# EAGLE design tobi_arduino_version (EAGLE 8.5.2)
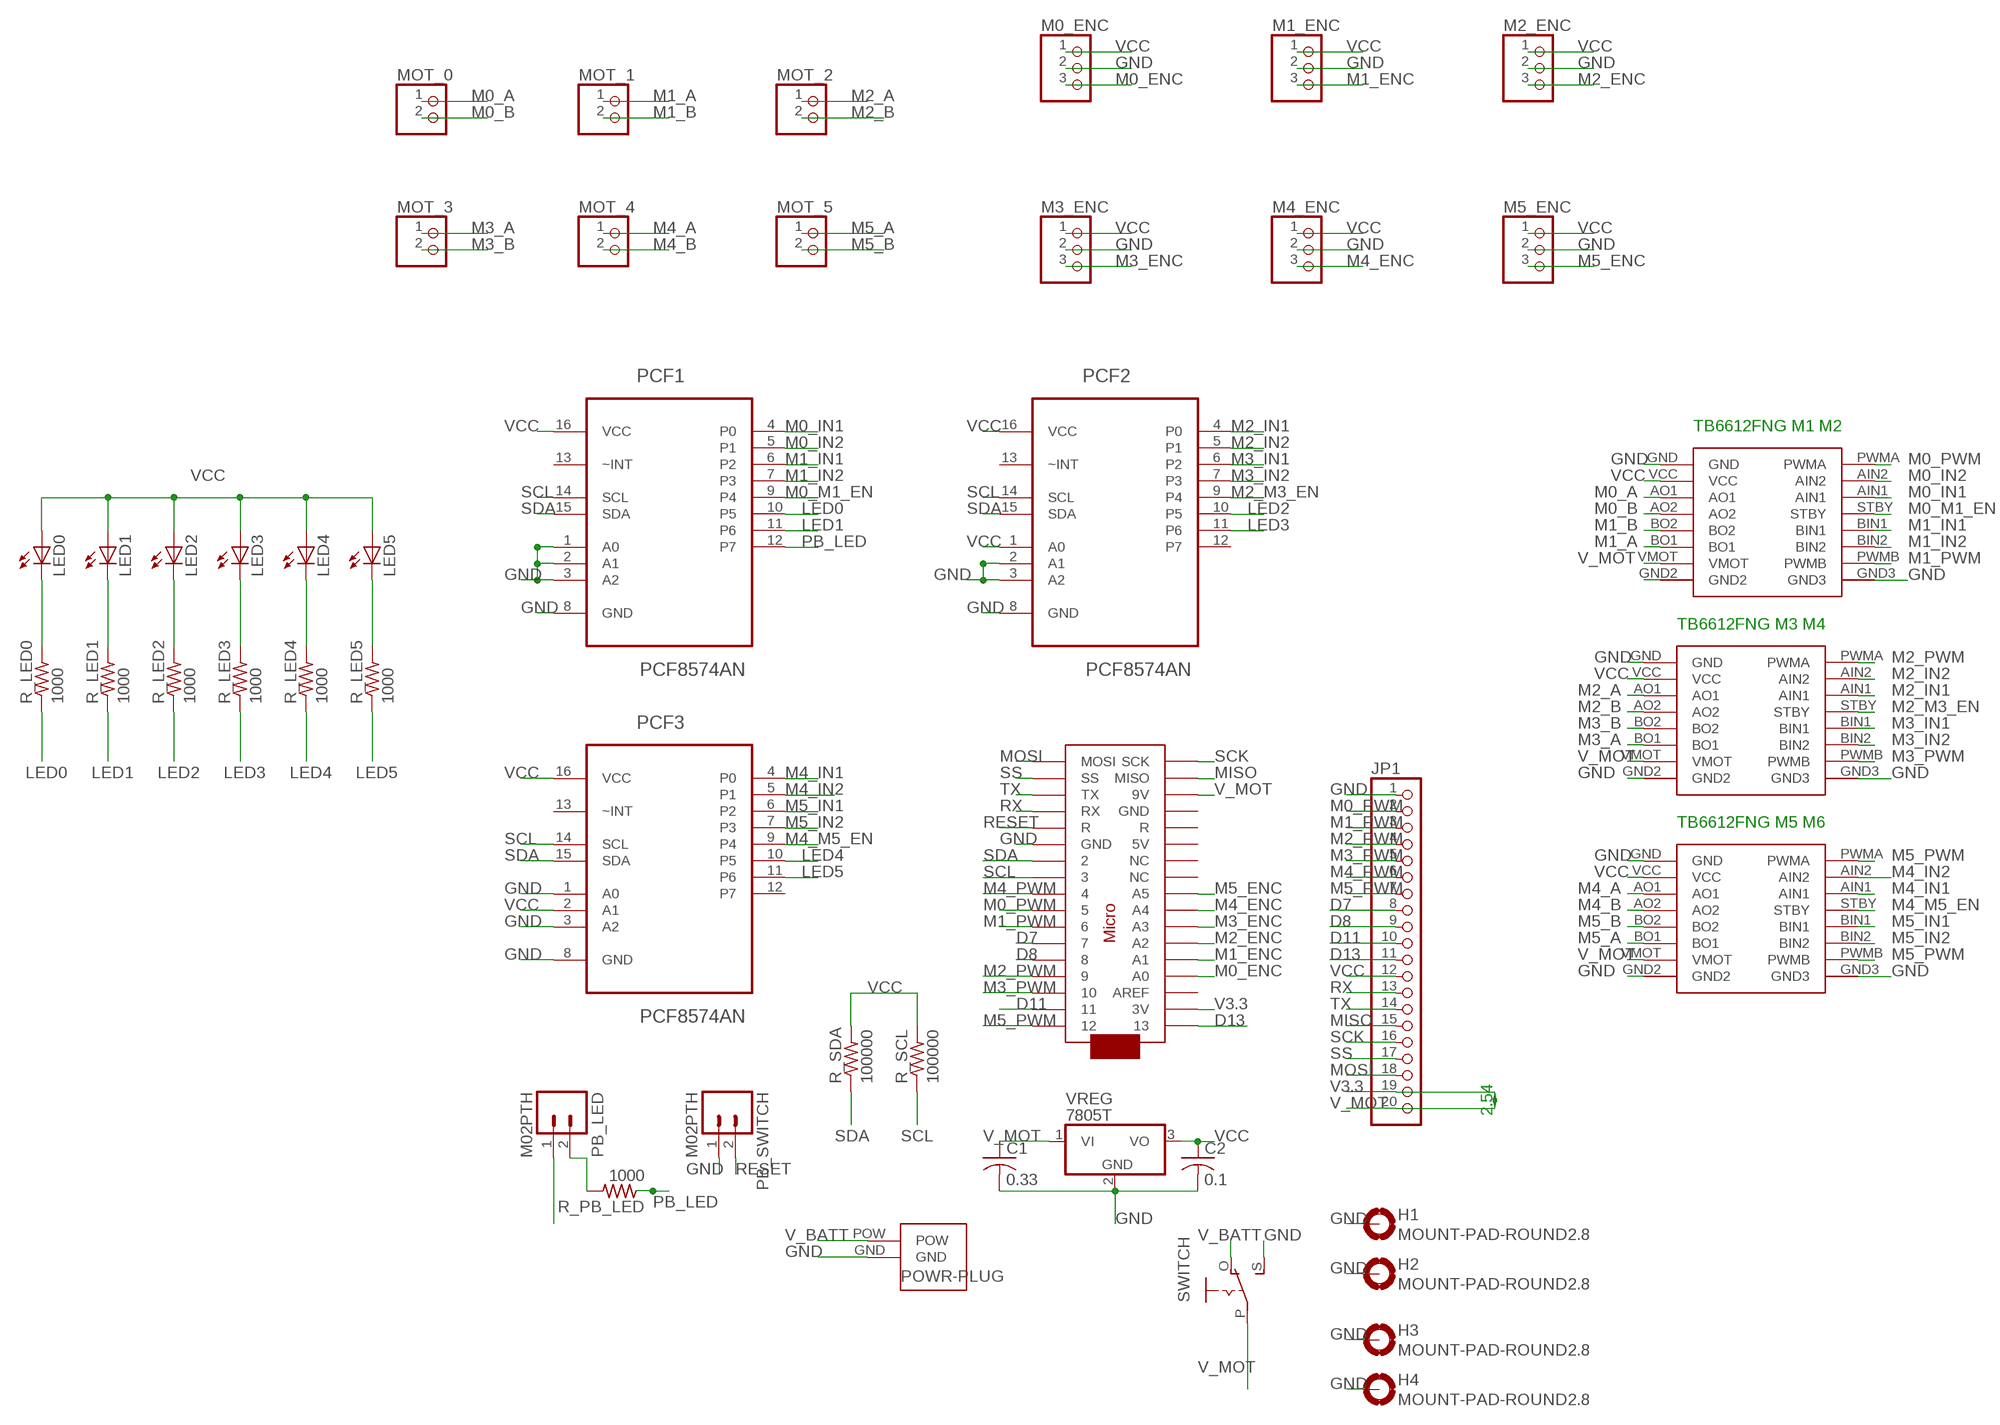
[diagram p0: schematic, sheet 1]

## Parts
ARDUINOMICRO  ARDUINOMICRO  [ARDUINOMICRO]
C1  0.33  C-US025-025X050  [C025-025X050]
C2  0.1  C-US025-025X050  [C025-025X050]
DRIVER1  POLOLU_MOTOR_DRV8835THROUGHHOLE  [POLOLU_MOTOR_DRV_DRV8835]
DRIVER2  POLOLU_MOTOR_DRV8835THROUGHHOLE  [POLOLU_MOTOR_DRV_DRV8835]
DRIVER3  POLOLU_MOTOR_DRV8835THROUGHHOLE  [POLOLU_MOTOR_DRV_DRV8835]
H1  MOUNT-PAD-ROUND2.8  [2,8-PAD]
H2  MOUNT-PAD-ROUND2.8  [2,8-PAD]
H3  MOUNT-PAD-ROUND2.8  [2,8-PAD]
H4  MOUNT-PAD-ROUND2.8  [2,8-PAD]
JP1  PINHD-1X20  [1X20]
LED0  LED3MM  [LED3MM]
LED1  LED3MM  [LED3MM]
LED2  LED3MM  [LED3MM]
LED3  LED3MM  [LED3MM]
LED4  LED3MM  [LED3MM]
LED5  LED3MM  [LED3MM]
M0_ENC  PINHD-1X3  [1X03]
M1_ENC  PINHD-1X3  [1X03]
M2_ENC  PINHD-1X3  [1X03]
M3_ENC  PINHD-1X3  [1X03]
M4_ENC  PINHD-1X3  [1X03]
M5_ENC  PINHD-1X3  [1X03]
MOT_0  PINHD-1X2  [1X02]
MOT_1  PINHD-1X2  [1X02]
MOT_2  PINHD-1X2  [1X02]
MOT_3  PINHD-1X2  [1X02]
MOT_4  PINHD-1X2  [1X02]
MOT_5  PINHD-1X2  [1X02]
PB_LED  M02PTH  [1X02]
PB_SWITCH  M02PTH  [1X02]
PCF1  PCF8574AN  [DIP254P762X508-16]
PCF2  PCF8574AN  [DIP254P762X508-16]
PCF3  PCF8574AN  [DIP254P762X508-16]
POWR-PLUG  MINI_DEANSSMD  [MINI_DEANS]
R_LED0  1000  R-US_0204/2V  [0204V]
R_LED1  1000  R-US_0204/2V  [0204V]
R_LED2  1000  R-US_0204/2V  [0204V]
R_LED3  1000  R-US_0204/2V  [0204V]
R_LED4  1000  R-US_0204/2V  [0204V]
R_LED5  1000  R-US_0204/2V  [0204V]
R_PB_LED  1000  R-US_0204/2V  [0204V]
R_SCL  100000  R-US_0204/2V  [0204V]
R_SDA  100000  R-US_0204/2V  [0204V]
SWITCH  EG1218S  [EG1218]
VREG  7805T  [TO220H]

## Nets
D7: ARDUINOMICRO.P$6 JP1.8
D8: ARDUINOMICRO.P$5 JP1.9
D11: ARDUINOMICRO.P$2 JP1.10
D13: ARDUINOMICRO.P$34 JP1.11
GND: ARDUINOMICRO.P$21(GND) C1.2 C2.2 DRIVER1.GND DRIVER1.GND2 DRIVER1.GND3 DRIVER2.GND DRIVER2.GND2 DRIVER2.GND3 DRIVER3.GND DRIVER3.GND2 DRIVER3.GND3 H1.B2,8(MOUNT) H2.B2,8(MOUNT) H3.B2,8(MOUNT) H4.B2,8(MOUNT) JP1.1 M0_ENC.2 M1_ENC.2 M2_ENC.2 M3_ENC.2 M4_ENC.2 M5_ENC.2 PB_SWITCH.1 PCF1.1(A0) PCF1.2(A1) PCF1.3(A2) PCF1.8(GND) PCF2.2(A1) PCF2.3(A2) PCF2.8(GND) PCF3.1(A0) PCF3.3(A2) PCF3.8(GND) POWR-PLUG.GND SWITCH.S VREG.2(GND)
LED0: LED0.K(C) PCF1.10(P5) R_LED0.1 R_LED0.2
LED1: LED1.K(C) PCF1.11(P6) R_LED1.1 R_LED1.2
LED2: LED2.K(C) PCF2.10(P5) R_LED2.1 R_LED2.2
LED3: LED3.K(C) PCF2.11(P6) R_LED3.1 R_LED3.2
LED4: LED4.K(C) PCF3.10(P5) R_LED4.1 R_LED4.2
LED5: LED5.K(C) PCF3.11(P6) R_LED5.1 R_LED5.2
M0_A: DRIVER1.AO1 MOT_0.1
M0_B: DRIVER1.AO2 MOT_0.2
M0_ENC: ARDUINOMICRO.P$31(A0) M0_ENC.3
M0_IN1: DRIVER1.AIN1 PCF1.4(P0)
M0_IN2: DRIVER1.AIN2 PCF1.5(P1)
M0_M1_EN: DRIVER1.STBY PCF1.9(P4)
M0_PWM: ARDUINOMICRO.P$8 DRIVER1.PWMA JP1.2
M1_A: DRIVER1.BO1 MOT_1.1
M1_B: DRIVER1.BO2 MOT_1.2
M1_ENC: ARDUINOMICRO.P$30(A1) M1_ENC.3
M1_IN1: DRIVER1.BIN1 PCF1.6(P2)
M1_IN2: DRIVER1.BIN2 PCF1.7(P3)
M1_PWM: ARDUINOMICRO.P$7 DRIVER1.PWMB JP1.3
M2_A: DRIVER2.AO1 MOT_2.1
M2_B: DRIVER2.AO2 MOT_2.2
M2_ENC: ARDUINOMICRO.P$29(A2) M2_ENC.3
M2_IN1: DRIVER2.AIN1 PCF2.4(P0)
M2_IN2: DRIVER2.AIN2 PCF2.5(P1)
M2_M3_EN: DRIVER2.STBY PCF2.9(P4)
M2_PWM: ARDUINOMICRO.P$4 DRIVER2.PWMA JP1.4
M3_A: DRIVER2.BO1 MOT_3.1
M3_B: DRIVER2.BO2 MOT_3.2
M3_ENC: ARDUINOMICRO.P$28(A3) M3_ENC.3
M3_IN1: DRIVER2.BIN1 PCF2.6(P2)
M3_IN2: DRIVER2.BIN2 PCF2.7(P3)
M3_PWM: ARDUINOMICRO.P$3 DRIVER2.PWMB JP1.5
M4_A: DRIVER3.AO1 MOT_4.1
M4_B: DRIVER3.AO2 MOT_4.2
M4_ENC: ARDUINOMICRO.P$27(A4) M4_ENC.3
M4_IN1: DRIVER3.AIN1 PCF3.4(P0)
M4_IN2: DRIVER3.AIN2 PCF3.5(P1)
M4_M5_EN: DRIVER3.STBY PCF3.9(P4)
M4_PWM: ARDUINOMICRO.P$9 JP1.6
M5_A: DRIVER3.BO1 MOT_5.1
M5_B: DRIVER3.BO2 MOT_5.2
M5_ENC: ARDUINOMICRO.P$26(A5) M5_ENC.3
M5_IN1: DRIVER3.BIN1 PCF3.6(P2)
M5_IN2: DRIVER3.BIN2 PCF3.7(P3)
M5_PWM: ARDUINOMICRO.P$1 DRIVER3.PWMA DRIVER3.PWMB JP1.7
MISO: ARDUINOMICRO.P$19(MISO) JP1.15
MOSI: ARDUINOMICRO.P$17(MOSI) JP1.18
N$1: PB_LED.2 R_PB_LED.2
PB_LED: PCF1.12(P7) R_PB_LED.1
RESET: ARDUINOMICRO.P$22(R) PB_SWITCH.2
RX: ARDUINOMICRO.P$14(RX) JP1.13
SCK: ARDUINOMICRO.P$18(SCK) JP1.16
SCL: ARDUINOMICRO.P$10 PCF1.14(SCL) PCF2.14(SCL) PCF3.14(SCL) R_SCL.1
SDA: ARDUINOMICRO.P$11 PCF1.15(SDA) PCF2.15(SDA) PCF3.15(SDA) R_SDA.1
SS: ARDUINOMICRO.P$16(SS) JP1.17
TX: ARDUINOMICRO.P$15(TX) JP1.14
V3.3: ARDUINOMICRO.P$33(3V) JP1.19
V_BATT: POWR-PLUG.POW SWITCH.O
V_MOT: ARDUINOMICRO.P$20(9V) C1.1 DRIVER1.VMOT DRIVER2.VMOT DRIVER3.VMOT JP1.20 SWITCH.P VREG.1(VI)
VCC: C2.1 DRIVER1.VCC DRIVER2.VCC DRIVER3.VCC JP1.12 LED0.A LED1.A LED2.A LED3.A LED4.A LED5.A M0_ENC.1 M1_ENC.1 M2_ENC.1 M3_ENC.1 M4_ENC.1 M5_ENC.1 PB_LED.1 PCF1.16(VCC) PCF2.1(A0) PCF2.16(VCC) PCF3.2(A1) PCF3.16(VCC) R_SCL.2 R_SDA.2 VREG.3(VO)
Unconnected: ARDUINOMICRO.P$12(GND) ARDUINOMICRO.P$13(R) ARDUINOMICRO.P$23(5V) ARDUINOMICRO.P$24(NC) ARDUINOMICRO.P$25(NC) ARDUINOMICRO.P$32(AREF) PCF1.13(~INT) PCF2.12(P7) PCF2.13(~INT) PCF3.12(P7) PCF3.13(~INT)

## Notes on the sheet
- TB6612FNG M1 M2
- TB6612FNG M3 M4
- TB6612FNG M5 M6

## Library data of the parts
ARDUINOMICRO = adafruit:ARDUINOMICRO
C1 C2 = adafruit:C-US: CAPACITOR, American symbol
DRIVER1-DRIVER3 = pololu:POLOLU_MOTOR_DRV8835
H1-H4 = holes:MOUNT-PAD-ROUND: MOUNTING PAD, round
JP1 = adafruit:PINHD-1X20: PIN HEADER
LED0 LED1-LED5 = adafruit:LED: LED OSRAM: - CHIPLED LG R971, LG N971, LY N971, LG Q971, LY Q971, LO R971, LY R971 LH N974, LH R974 LS Q976, LO Q976, LY Q976 LO Q996 - Hyper CHIPLED LW Q18S LB Q993, LB Q99A, LB R99A - SideLED LS A670, LO A670, LY A670, LG A670, LP A670 LB A673, LV A673, LT A673, LW A673 LH A674 LY A675 LS A676, LA A676, LO A676, LY A676, LW A676 LS A679, LY A679, LG A679 - Hyper Micro SIDELED® LS Y876, LA Y876, LO Y876, LY Y876 LT Y87S - SmartLED LW L88C, LW L88S LB L89C, LB L89S, LG L890 LS L89K, LO L89K, LY L89K LS L896, LA L896, LO L896, LY L896 - TOPLED LS T670, LO T670, LY T670, LG T670, LP T670 LSG T670, LSP T670, LSY T670, LOP T670, LYG T670 LG T671, LOG T671, LSG T671 LB T673, LV T673, LT T673, LW T673 LH T674 LS T676, LA T676, LO T676, LY T676, LB T676, LH T676, LSB T676, LW T676 LB T67C, LV T67C, LT T67C, LS T67K, LO T67K, LY T67K, LW E67C LS E67B, LA E67B, LO E67B, LY E67B, LB E67C, LV E67C, LT E67C LW T67C LS T679, LY T679, LG T679 LS T770, LO T770, LY T770, LG T770, LP T770 LB T773, LV T773, LT T773, LW T773 LH T774 LS E675, LA E675, LY E675, LS T675 LS T776, LA T776, LO T776, LY T776, LB T776 LHGB T686 LT T68C, LB T68C - Hyper Mini TOPLED® LB M676 - Mini TOPLED Santana® LG M470 LS M47K, LO M47K, LY M47K Source: http://www.osram.convergy.de/
M0_ENC M1_ENC M2_ENC M3_ENC M4_ENC M5_ENC = pinhead:PINHD-1X3: PIN HEADER
MOT_0 MOT_1-MOT_5 = pinhead:PINHD-1X2: PIN HEADER
PB_LED PB_SWITCH = SparkFun-Connectors:M02: Standard 2-pin 0.1" header. Use with - straight break away headers ( PRT-00116) - right angle break away headers (PRT-00553) - swiss pins (PRT-00743) - machine pins (PRT-00117) - female headers (PRT-00115) Molex polarized connector foot print use with: PRT-08233 with associated crimp pins and housings. 2.54_SCREWTERM for use with PRT-10571. 3.5mm Screw Terminal footprints for PRT-08084 5mm Screw Terminal footprints for use with PRT-08433
PCF1-PCF3 = Texas Instruments_By_element14_Batch_1:PCF8574AN: REMOTE 8-BIT I/O EXPANDER FOR I2C BUS; MPN: PCF8574AN; OC_FARNELL: 1703443; OC_NEWARK: 75C5234; PACKAGE: PDIP-16; SUPPLIER: Texas Instruments
POWR-PLUG = SparkFun-Connectors:MINI_DEANS: EB-85A Connector Proven layout and schematic for ETek 5Hz GPS receiver connector. Spark Fun Electronics SKU : GPS-08297
R_LED0 R_LED1-R_LED5 R_PB_LED R_SCL R_SDA = resistor:R-US_: RESISTOR, American symbol
SWITCH = adafruit:EG1218: SLIDING SWITCH 0.1" spacing through hole, vertical SPDT slide switch http://www.ladyada.net/library/pcb/eaglelibrary.html
VREG = adafruit:78*: Positive VOLTAGE REGULATOR Added bigger pads to the TO-92 package

## Net classes
0 default: width 0.254 mm, clearance 0.127 mm

## Board
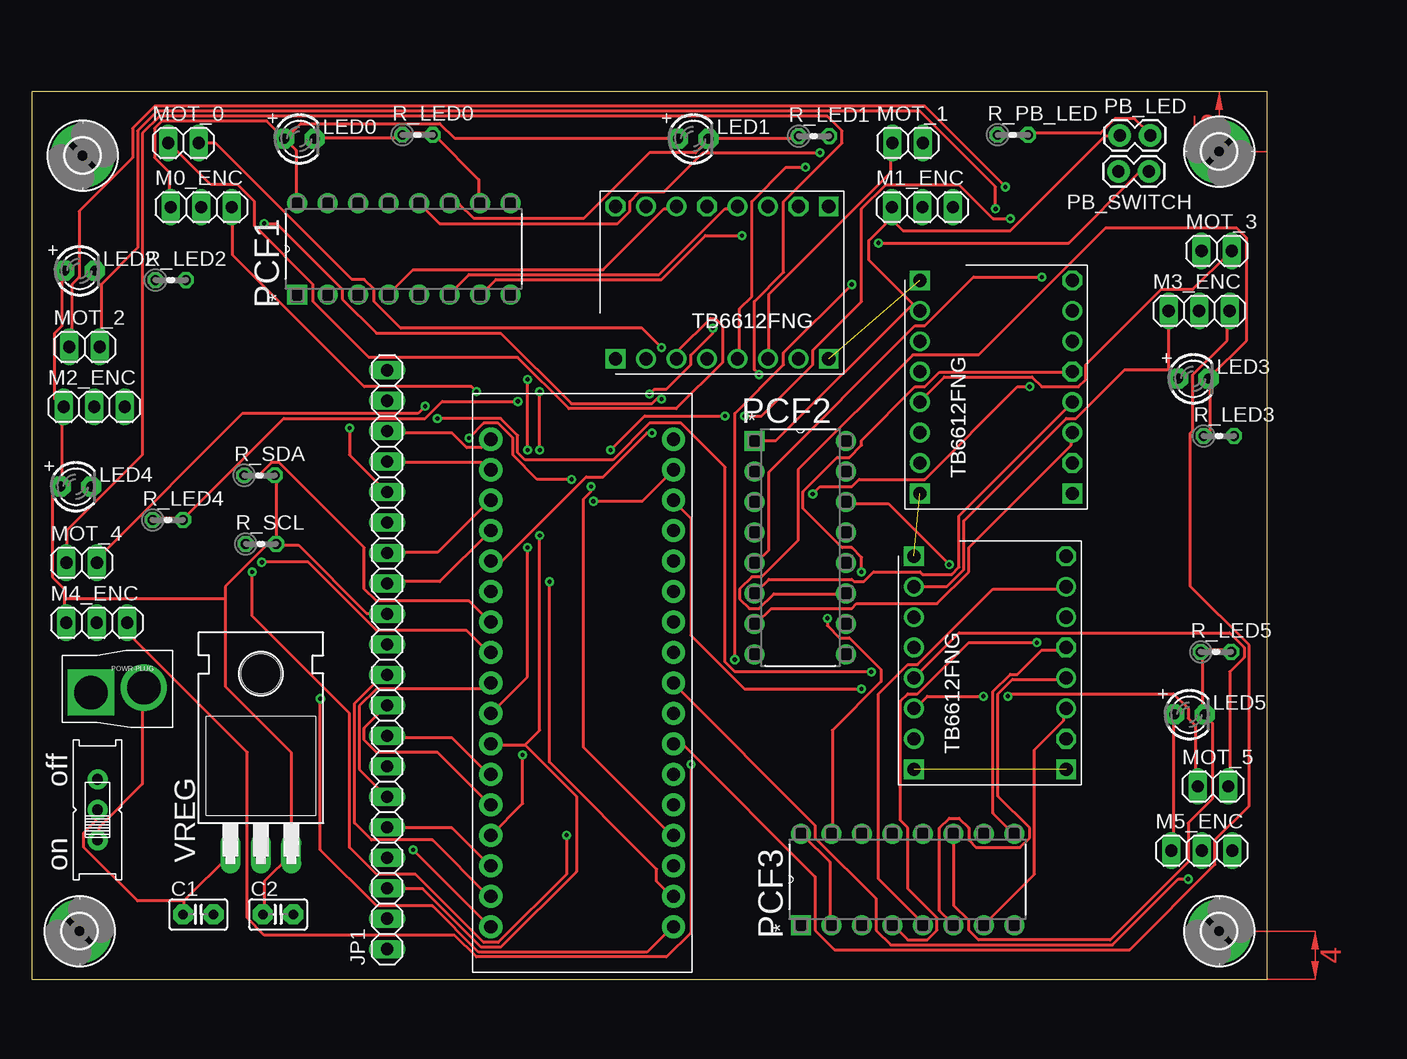
[diagram p1: board, top side]
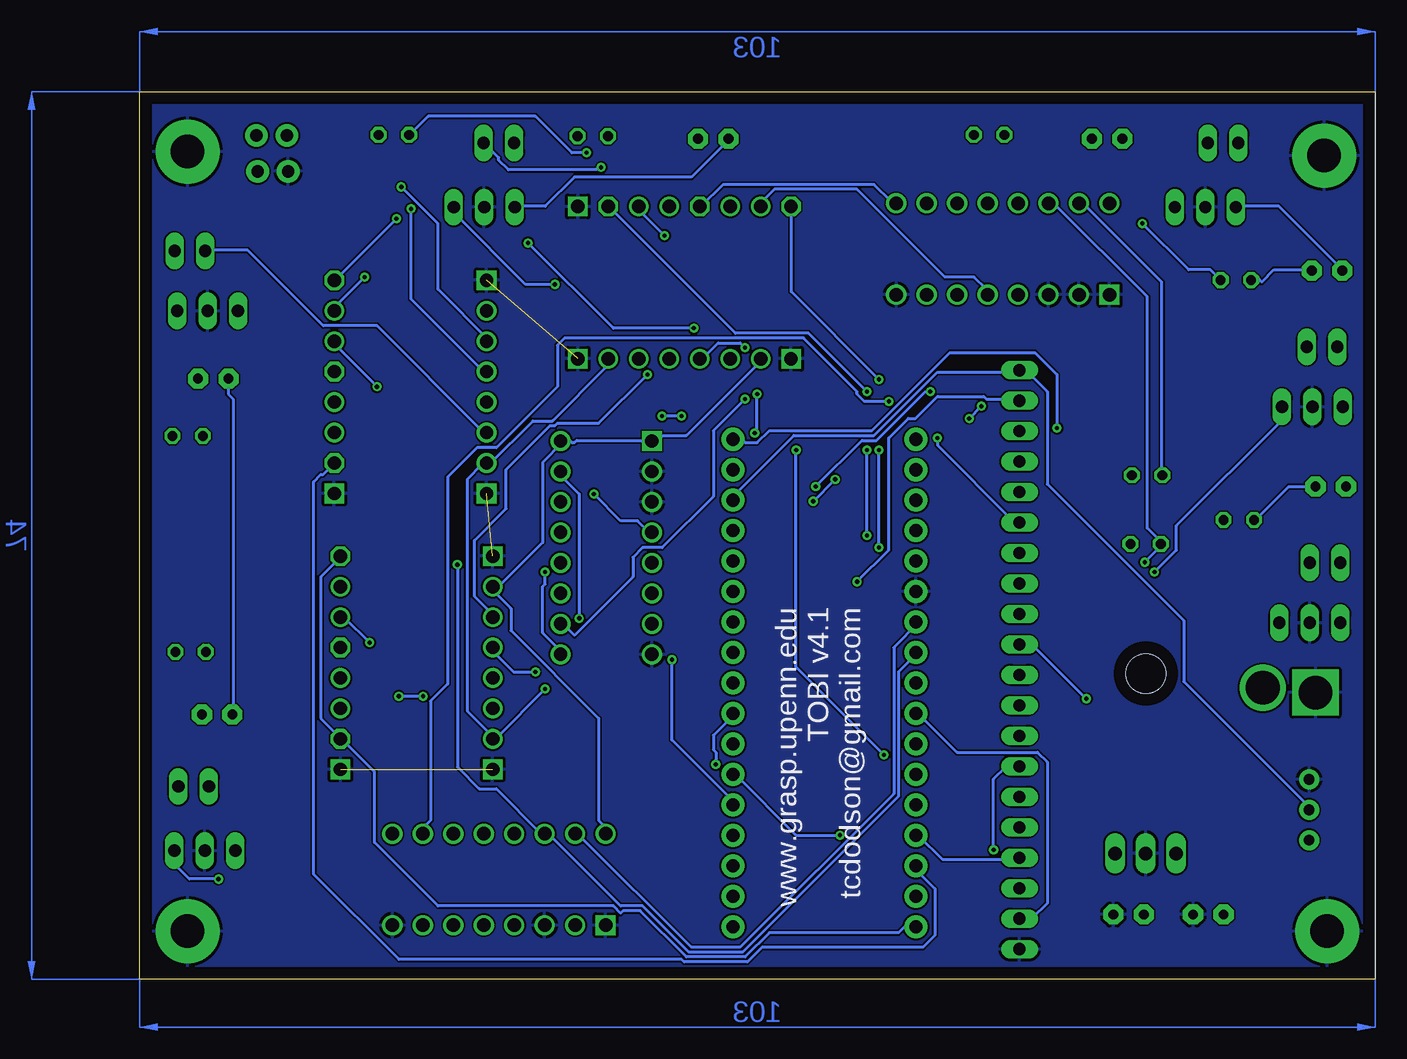
[diagram p2: board, bottom side, seen from below]

Size 103 x 74 mm. Coordinates in mm from the lower left corner, seen from the top.
Outline: 0,0 103,0 103,74 0,74 0,0
Copper layers (1*16): Top 0.035mm / dielectric 1.5mm / Bottom 0.035mm
Design rules "default": minimum track width 6mil, minimum drill 0.35mm, track to track 6mil, track to pad 6mil, pad to pad 6mil, via to via 6mil, smd to smd 6mil, copper to edge 40mil, drill to drill 6mil, minimum pad ring 10mil, minimum via ring 8mil, stop-mask expansion 4mil, vias tented up to drill 0mil, thermal gap 10mil

### Footprints (pad centres in the part's own frame; a part is rotated, then mirrored left to right if it is on the bottom)
ARDUINOMICRO = drill 1.1 pad 1.93: P$1 -20.32,7.62; P$2 -17.78,7.62; P$3 -15.24,7.62; P$4 -12.7,7.62; P$5 -10.16,7.62; P$6 -7.62,7.62; P$7 -5.08,7.62; P$8 -2.54,7.62; P$9 0,7.62; P$10 2.54,7.62; P$11 5.08,7.62; P$12 12.7,-7.62; P$13 10.16,-7.62; P$14 12.7,7.62; P$15 15.24,7.62; P$16 17.78,7.62; P$17 20.32,7.62; P$18 20.32,-7.62; P$19 17.78,-7.62; P$20 15.24,-7.62; P$21 7.62,7.62; P$22 10.16,7.62; P$23 7.62,-7.62; P$24 5.08,-7.62; P$25 2.54,-7.62; P$26 0,-7.62; P$27 -2.54,-7.62; P$28 -5.08,-7.62; P$29 -7.62,-7.62; P$30 -10.16,-7.62; P$31 -12.7,-7.62; P$32 -15.24,-7.62; P$33 -17.78,-7.62; P$34 -20.32,-7.62
C025-025X050 = drill 0.813 pad 1.676 octagon: 1 -1.27,0; 2 1.27,0
POLOLU_MOTOR_DRV_DRV8835 = drill 1.1: AIN1 13.97,13.97; AIN2 13.97,16.51; AO1 1.27,13.97; AO2 1.27,11.43; BIN1 13.97,8.89; BIN2 13.97,6.35; BO1 1.27,6.35; BO2 1.27,8.89; VCC 1.27,16.51; VMOT 1.27,3.81 | drill 1.1 square: GND 1.27,19.05; GND2 1.27,1.27; GND3 13.97,1.27 | drill 1.1 octagon: PWMA 13.97,19.05; PWMB 13.97,3.81; STBY 13.97,11.43
2,8-PAD = drill 2.8 pad 5.334: B2,8 0,0
1X20 = drill 1.016 long: 1 -24.13,0; 2 -21.59,0; 3 -19.05,0; 4 -16.51,0; 5 -13.97,0; 6 -11.43,0; 7 -8.89,0; 8 -6.35,0; 9 -3.81,0; 10 -1.27,0; 11 1.27,0; 12 3.81,0; 13 6.35,0; 14 8.89,0; 15 11.43,0; 16 13.97,0; 17 16.51,0; 18 19.05,0; 19 21.59,0; 20 24.13,0
LED3MM = drill 0.813 pad 1.676 octagon: A -1.27,0; K 1.27,0
1X03 = drill 1.016 long: 1 -2.54,0; 2 0,0; 3 2.54,0
1X02 = drill 1.016 long: 1 -1.27,0; 2 1.27,0
1X02' = drill 1.016 pad 1.88: 1 0,0; 2 2.54,0
DIP254P762X508-16 = drill 1.118 square: 1 -7.62,17.78 | drill 1.118: 2 -7.62,15.24; 3 -7.62,12.7; 4 -7.62,10.16; 5 -7.62,7.62; 6 -7.62,5.08; 7 -7.62,2.54; 8 -7.62,0; 9 0,0; 10 0,2.54; 11 0,5.08; 12 0,7.62; 13 0,10.16; 14 0,12.7; 15 0,15.24; 16 0,17.78
MINI_DEANS = drill 2.8 pad 3.85 square: GND -1.7,-0.5 | drill 2.8 pad 3.85: POW 2.7,-0.1
0204V = drill 0.813 octagon: 1 -1.27,0; 2 1.27,0
EG1218 = drill 0.9 pad 1.676: O -2.54,0; P 0,0; S 2.54,0
TO220H = drill 1.118 long: 1 -2.54,-10.16; 2 0,-10.16; 3 2.54,-10.16 | hole 3.302: 0,4.826

### Placement (x,y rotation side)
ARDUINOMICRO  45.9,24.69 90 top
C1  13.9,5.39 0 top
C2  20.55,5.39 0 top
DRIVER1  67.73,50.45 90 top
DRIVER2  72.79,39.21 0 top
DRIVER3  72.28,16.21 0 top
H1  4,4 0 top
H2  99,4 0 top
H3  99,69 270 top
H4  4.25,68.66 0 top
JP1  29.64,26.63 90 top
LED0  22.33,70.06 0 top
LED1  55.17,70.06 0 top
LED2  4.01,59.06 0 top
LED3  96.85,50.06 0 top
LED4  3.69,41.06 0 top
LED5  96.53,22.06 0 top
M0_ENC  14.15,64.36 0 top
M1_ENC  74.26,64.36 0 top
M2_ENC  5.22,47.71 0 top
M3_ENC  97.33,55.71 0 top
M4_ENC  5.44,29.71 0 top
M5_ENC  97.55,10.71 0 top
MOT_0  12.66,69.71 0 top
MOT_1  73.04,69.71 0 top
MOT_2  4.42,52.71 0 top
MOT_3  98.8,60.71 0 top
MOT_4  4.18,34.71 0 top
MOT_5  98.49,16.06 0 top
PB_LED  M02PTH  [1X02']  90.72,70.34 0 top
PB_SWITCH  M02PTH  [1X02']  90.61,67.34 0 top
PCF1  39.92,64.68 90 top
PCF2  67.9,27.08 0 top
PCF3  81.92,12.12 90 top
POWR-PLUG  6.66,24.39 0 top
R_LED0  32.18,70.39 0 top
R_LED1  65.22,70.28 0 top
R_LED2  11.6,58.28 0 top
R_LED3  98.98,45.28 0 top
R_LED4  11.36,38.28 0 top
R_LED5  98.74,27.28 0 top
R_PB_LED  81.8,70.39 0 top
R_SCL  19.12,36.28 0 top
R_SDA  19,42 0 top
SWITCH  5.5,14.12 90 top
VREG  19.12,20.64 0 top

### Tracks (layer width: path | path; a pad name or v marks a point on that pad's centre or on a via)
D7
  Top 0.254: JP1.8 29.77,20.13 35.05,20.13 38.1,17.08 ARDUINOMICRO.P$6
D8
  Top 0.254: JP1.9 29.56,22.77 27.73,20.94 27.73,19.92 28.75,18.91 33.83,18.91 38.1,14.64 ARDUINOMICRO.P$5
D11
  Top 0.254: JP1.10 29.56,25.21 29.16,25.21 26.92,22.97 26.92,13.01 28.34,11.59 33.42,11.59 38.1,6.92 ARDUINOMICRO.P$2
D13  (via drill 0.35)
  Top 0.254: v24.08,23.38 24.08,10.78 28.75,6.11 33.42,6.11 37.28,2.25 51.31,2.25 53.34,4.28 ARDUINOMICRO.P$34
  Bottom 0.254: v24.08,23.38 28.55,27.85 29.56,27.85 JP1.11
GND  (3 unrouted)
  pour Bottom: 0,0 103,0 103,74 0,74
LED0
  Top 0.254: PCF1.10 37.28,64.83 37.28,66.66 33.63,70.32 R_LED0.2 33.42,70.52 30.99,70.52 R_LED0.1 30.78,70.32 30.58,70.11 23.67,70.11 LED0.K
LED1
  Top 0.254: R_LED1.2 66.34,70.32 64.11,70.32 R_LED1.1 63.9,70.11 56.59,70.11 LED1.K 56.39,69.91 55.37,68.89 51.51,68.89 46.02,63.41 36.88,63.41 35.66,64.63 34.85,64.63 PCF1.11
LED2  (via drill 0.35)
  Top 0.254: R_LED2.1 10.46,58.33 12.7,58.33 R_LED2.2 | v52.53,48.37 52.12,48.37 51.71,47.97 45.01,47.97 39.11,53.86 28.75,53.86 25.91,56.7 25.91,57.52 20.42,63 v19.4,63
  Bottom 0.254: LED2.K 5.38,59.14 8.43,59.14 9.45,58.12 9.65,58.33 10.26,58.33 R_LED2.1 | v52.53,48.37 55.17,45.73 55.17,40.24 59.43,35.98 61.06,35.98 61.87,35.16 61.87,33.54 66.75,28.66 67.56,29.47 67.77,29.47 PCF2.10 | v19.4,63 15.54,59.14 13.71,59.14 12.9,58.33 R_LED2.2
LED3
  Top 0.254: 98.25,45.32 100.07,45.32 R_LED3.2 | 98.25,45.32 97.84,45.32 R_LED3.1 98.25,45.32 | PCF2.11 67.77,32.12 61.87,32.12 60.65,30.9 59.84,30.9 59.03,31.71 59.03,32.52 60.04,33.54 60.86,33.54 63.9,36.59 63.9,42.48 73.45,52.03 78.94,52.03 89.51,62.59 100.48,62.59 101.29,61.78 101.29,53.25 98.25,50.2 LED3.K 98.25,50 98.25,45.32
LED4  (via drill 0.35)
  Top 0.254: R_LED4.1 10.26,38.41 12.49,38.41 R_LED4.2 12.7,38.41 21.03,46.75 32.81,46.75 34.24,48.17 v40.54,48.17
  Bottom 0.254: LED4.K 4.98,41.06 7.21,41.06 10.06,38.21 R_LED4.1 | v40.54,48.17 42.57,48.17 43.18,48.78 43.18,48.98 47.65,53.45 67.56,53.45 68.17,52.84 68.17,49.39 73.25,44.31 74.88,44.31 77.31,41.87 77.31,24.6 78.74,23.17 78.74,13.22 79.35,12.61 79.35,12.2 PCF3.10
LED5
  Top 0.254: R_LED5.2 99.87,27.44 97.63,27.44 R_LED5.1 97.63,27.24 97.63,22.16 LED5.K 97.84,21.95 98.45,21.35 98.45,15.05 96.42,13.01 96.42,9.76 89.91,3.26 78.94,3.26 78.13,4.07 78.13,4.89 76.91,6.11 76.91,12 PCF3.11
M0_A
  Top 0.254: MOT_0.1 11.48,69.71 14.93,66.25 17.17,66.25 18.59,64.83 18.59,62.8 23.47,57.92 23.47,56.5 28.14,51.83 40.54,51.83 44.8,47.56 53.74,47.56 57.61,51.42 57.61,54.47 57,55.08 56.59,55.08 53.95,52.44 53.95,51.83 DRIVER1.AO1
M0_B  (via drill 0.35)
  Top 0.254: v52.53,52.64 50.9,54.26 30.78,54.26 28.55,56.5 28.55,57.52 27.73,58.33 26.72,58.33 15.34,69.71 14.12,69.71 MOT_0.2
  Bottom 0.254: v52.53,52.64 52.93,53.05 54.76,53.05 56.18,51.62 DRIVER1.AO2
M0_ENC  (via drill 0.35)
  Top 0.254: v37.08,48.98 36.67,49.39 27.73,49.39 16.76,60.36 16.76,64.22 M0_ENC.3 | v46.63,41.06 46.63,40.65 46.02,40.04 46.02,19.31 53.34,12 ARDUINOMICRO.P$31
  Bottom 0.254: v37.08,48.98 37.49,48.98 41.55,44.92 42.77,44.92 v46.63,41.06
M0_IN1
  Top 0.254: DRIVER1.AIN1 53.74,64.22 52.73,64.22 47.65,59.14 31.8,59.14 29.77,57.11 PCF1.4
M0_IN2
  Bottom 0.254: DRIVER1.AIN2 51.1,64.42 51.1,64.83 50.09,65.85 43.18,65.85 35.86,58.53 33.42,58.53 32.41,57.52 32.41,57.11 PCF1.5
M0_M1_EN
  Bottom 0.254: DRIVER1.STBY 56.18,64.42 54.35,66.25 41.75,66.25 40.33,64.83 39.93,64.83 PCF1.9
M0_PWM  (via drill 0.35)
  Top 0.254: v41.35,44.1 v41.35,50 | v41.35,35.98 41.35,25.21 38.3,22.16 ARDUINOMICRO.P$8
  Bottom 0.254: JP1.2 29.56,5.09 28.55,5.09 27.33,6.31 27.33,18.09 28.14,18.91 34.85,18.91 38.1,22.16 ARDUINOMICRO.P$8 | v41.35,50 48.66,57.31 48.66,64.22 DRIVER1.PWMA | v41.35,35.98 v41.35,44.1
M1_A
  Top 0.254: MOT_1.1 71.63,69.71 71.63,67.27 61.47,57.11 61.47,51.83 DRIVER1.BO1
M1_B  (via drill 0.35)
  Top 0.254: v64.51,67.67 62.89,67.67 60.04,64.83 60.04,56.91 59.03,55.89 59.03,51.83 DRIVER1.BO2
  Bottom 0.254: v64.51,67.67 64.72,67.47 72.24,67.47 73.05,68.28 73.05,68.49 74.27,69.71 MOT_1.2
M1_ENC  (via drill 0.35)
  Top 0.254: v68.37,57.92 62.69,52.23 62.69,51.22 58.62,47.15 v58.62,26.63
  Bottom 0.254: v68.37,57.92 70.81,57.92 76.71,63.81 76.71,64.22 M1_ENC.3 | v58.62,26.63 58.62,19.92 53.34,14.64 ARDUINOMICRO.P$30
M1_IN1
  Top 0.254: DRIVER1.BIN1 58.82,64.22 57.81,64.22 52.32,58.73 36.47,58.73 34.85,57.11 PCF1.6
M1_IN2  (via drill 0.35)
  Top 0.254: v59.23,61.99 56.18,61.99 52.53,58.33 38.71,58.33 37.49,57.11 PCF1.7
  Bottom 0.254: v59.23,61.99 61.26,64.02 61.26,64.22 DRIVER1.BIN2
M1_PWM  (via drill 0.35)
  Top 0.254: 41.15,19.52 45.41,15.25 45.41,8.95 39.11,2.65 37.49,2.65 32.61,7.53 29.77,7.53 JP1.3 | 41.15,19.52 38.3,19.52 ARDUINOMICRO.P$7 | v42.36,44.1 v42.36,48.98 | v42.36,36.99 42.36,20.74 41.15,19.52
  Bottom 0.254: v42.36,48.98 47.24,53.86 53.34,53.86 63.7,64.22 63.9,64.22 DRIVER1.PWMB | v42.36,36.99 v42.36,44.1
M2_A  (via drill 0.35)
  Top 0.254: v81.18,66.05 74.47,72.75 10.26,72.75 8.43,70.93 8.43,68.49 3.96,64.02 3.96,58.53 3.35,57.92 3.35,52.84 MOT_2.1
  Bottom 0.254: v81.18,66.05 78.13,63 78.13,57.52 73.86,53.25 DRIVER2.AO1
M2_B  (via drill 0.35)
  Top 0.254: v80.36,64.22 80.36,66.05 74.06,72.35 10.46,72.35 8.84,70.72 8.84,60.97 5.79,57.92 5.79,52.84 MOT_2.2
  Bottom 0.254: v80.36,64.22 80.36,56.7 74.47,50.81 74.06,50.81 DRIVER2.AO2
M2_ENC  (via drill 0.35)
  Top 0.254: v18.39,33.94 18.39,30.29 26.52,22.16 26.52,10.98 28.75,8.75 32,8.75 37.69,3.06 38.91,3.06 44.6,8.75 v44.6,12
  Bottom 0.254: v18.39,33.94 16.56,35.77 16.56,37.8 7.82,46.54 7.82,47.56 M2_ENC.3 | v44.6,12 48.26,12 53.34,17.08 ARDUINOMICRO.P$29
M2_IN1  (via drill 0.35)
  Top 0.254: v83.21,49.39 82.19,49.39 74.47,41.67 68.98,41.67 68.37,41.06 65.73,41.06 v65.12,40.45
  Bottom 0.254: v83.21,49.39 86.66,52.84 86.66,53.05 DRIVER2.AIN1 | v65.12,40.45 62.89,38.21 61.47,38.21 60.45,37.2 PCF2.4
M2_IN2  (via drill 0.35)
  Top 0.254: v84.22,58.53 78.53,58.53 74.47,54.47 73.66,54.47 61.47,42.28 61.47,35.77 60.45,34.76 PCF2.5
  Bottom 0.254: v84.22,58.53 86.66,56.09 86.66,55.89 DRIVER2.AIN2
M2_M3_EN  (via drill 0.35)
  Top 0.254: v69.19,33.94 69.19,35.16 68.37,35.98 67.56,35.98 64.31,39.23 64.31,40.65 67.16,43.49 68.17,43.49 69.19,44.51 69.19,44.92 73.66,49.39 74.47,49.39 75.69,50.61 86.66,50.61 DRIVER2.STBY
  Bottom 0.254: v69.19,33.94 69.19,32.93 69.39,32.73 69.39,28.86 67.77,27.24 PCF2.9
M2_PWM  (via drill 0.35)
  Top 0.254: v81.58,63.41 80.16,63.41 77.31,66.25 71.22,66.25 69.19,64.22 69.19,56.5 65.12,52.44 65.12,51.22 60.86,46.95 v59.43,46.95 | v57.81,46.95 51.1,46.95 v48.26,44.1 | v40.94,18.7 40.94,14.64 38.3,12 ARDUINOMICRO.P$4
  Bottom 0.254: JP1.4 29.77,9.97 36.07,9.97 38.1,12 ARDUINOMICRO.P$4 | v81.58,63.41 86.66,58.33 DRIVER2.PWMA | v57.81,46.95 v59.43,46.95 | v48.26,44.1 48.26,26.02 v40.94,18.7
M3_A
  Bottom 0.254: MOT_3.1 97.43,60.77 93.98,60.77 87.68,54.47 83.21,54.47 74.47,45.73 74.06,45.73 DRIVER2.BO1
M3_B
  Top 0.254: MOT_3.2 99.87,60.56 96.82,57.52 94.18,57.52 87.88,51.22 87.88,50 87.27,49.39 84.22,49.39 83.41,50.2 76.1,50.2 74.06,48.17 DRIVER2.BO2
M3_ENC
  Top 0.254: M3_ENC.3 99.67,55.69 99.67,53.25 96.82,50.4 96.82,45.73 96.62,45.53 96.62,32.73 101.5,27.85 101.5,14.44 98.65,11.59 98.65,9.56 91.54,2.45 66.95,2.45 65.33,4.07 65.33,8.54 54.35,19.52 53.54,19.52 ARDUINOMICRO.P$28
M3_IN1
  Top 0.254: DRIVER2.BIN1 86.66,47.97 77.31,38.62 77.31,34.35 76.71,33.74 74.27,33.74 74.06,33.94 70.2,33.94 69.39,33.13 68.58,33.13 68.37,33.33 61.47,33.33 60.45,32.32 PCF2.6
M3_IN2
  Top 0.254: DRIVER2.BIN2 86.66,45.53 86.66,44.51 78.13,35.98 78.13,33.94 75.49,31.3 68.78,31.3 68.37,30.9 61.67,30.9 60.45,29.68 PCF2.7
M3_PWM
  Top 0.254: JP1.5 29.77,12.61 35.05,12.61 38.1,9.56 ARDUINOMICRO.P$3
  Bottom 0.254: DRIVER2.PWMB 86.87,42.89 87.68,42.07 87.88,42.07 88.49,41.46 88.49,8.75 81.38,1.64 57.81,1.64 57.61,1.43 52.32,1.43 51.1,2.65 37.69,2.65 36.67,3.67 36.67,7.53 38.1,8.95 38.1,9.36 ARDUINOMICRO.P$3
M4_A  (via drill 0.35)
  Top 0.254: v60.65,50.4 60.25,50.81 60.25,56.5 62.69,58.94 62.69,64.83 67.56,69.71 67.56,70.72 66.34,71.94 10.67,71.94 9.24,70.52 9.24,43.7 2.94,37.4 2.94,34.76 MOT_4.1
  Bottom 0.254: v60.65,50.4 64.72,46.34 68.17,46.34 68.37,46.14 68.78,46.14 72.44,42.48 72.44,39.23 75.08,36.59 75.08,31.91 73.45,30.29 DRIVER3.AO1
M4_B  (via drill 0.35)
  Top 0.254: v32.81,47.76 32.2,47.15 17.57,47.15 5.59,35.16 5.59,34.76 MOT_4.2 | v33.83,46.75 39.11,46.75 40.54,45.32 40.54,43.9 41.15,43.29 48.46,43.29 51.51,46.34 54.15,46.34 57.81,42.68 57.81,26.43 58.62,25.61 v70,25.61
  Bottom 0.254: v33.83,46.75 v32.81,47.76 | v70,25.61 71.83,25.61 73.66,27.44 DRIVER3.AO2
M4_ENC  (via drill 0.35)
  Top 0.254: v54.96,17.89 54.96,3.87 52.93,1.84 37.08,1.84 35.25,3.67 19.4,3.67 17.98,5.09 17.98,18.91 8.02,28.86 8.02,29.68 M4_ENC.3
  Bottom 0.254: v54.96,17.89 54.96,18.91 55.17,19.11 55.17,20.33 53.54,21.95 ARDUINOMICRO.P$27
M4_IN1  (via drill 0.35)
  Top 0.254: v83.82,28.05 78.13,28.05 73.86,23.78 73.05,23.78 72.44,23.17 72.44,13.22 73.05,12.61 73.05,7.53 75.49,5.09 75.49,4.07 74.67,3.26 73.05,3.26 71.83,4.48 PCF3.4
  Bottom 0.254: v83.82,28.05 85.85,30.08 86.05,30.08 DRIVER3.AIN1
M4_IN2
  Top 0.254: DRIVER3.AIN2 86.05,32.52 80.16,32.52 73.86,26.22 73.05,26.22 70.61,23.78 70.61,8.34 74.27,4.68 PCF3.5
M4_M5_EN
  Top 0.254: DRIVER3.STBY 86.05,27.44 84.22,27.44 82.19,25.41 81.58,25.41 80.16,23.99 80.16,13.83 81.79,12.2 PCF3.9
M4_PWM
  Top 0.254: JP1.6 29.56,15.25 27.33,17.48 27.33,22.77 28.75,24.19 37.69,24.19 38.1,24.6 ARDUINOMICRO.P$9
M5_A  (via drill 0.35)
  Top 0.254: v81.38,23.58 81.58,23.78 95.2,23.78 96.42,22.56 96.42,21.75 97.03,21.14 97.03,16.06 MOT_5.1 | v79.35,23.58 74.67,23.58 73.66,22.56 DRIVER3.BO1
  Bottom 0.254: v79.35,23.58 v81.38,23.58
M5_B
  Top 0.254: MOT_5.2 99.87,16.06 99.87,25.61 101.09,26.83 101.09,27.65 99.87,28.86 77.31,28.86 73.66,25.21 DRIVER3.BO2
M5_ENC  (via drill 0.35)
  Top 0.254: v96.42,8.34 95.6,8.34 90.12,2.85 71.63,2.85 70.41,4.07 70.41,6.72 65.33,11.8 65.33,12.81 53.54,24.6 ARDUINOMICRO.P$26
  Bottom 0.254: v96.42,8.34 98.85,8.34 100.07,9.56 100.07,10.58 M5_ENC.3
M5_IN1
  Top 0.254: DRIVER3.BIN1 86.05,25 81.79,25 80.57,23.78 80.57,15.25 83.21,12.61 83.21,11.8 82.4,10.98 78.74,10.98 78.13,11.59 78.13,12.61 77.31,13.42 76.5,13.42 75.69,12.61 75.69,5.7 76.71,4.68 PCF3.6
M5_IN2
  Top 0.254: DRIVER3.BIN2 86.05,22.36 86.05,21.55 83.61,19.11 83.61,8.75 79.55,4.68 PCF3.7
M5_PWM  (via drill 0.35)
  Top 0.254: v31.8,10.78 38.1,4.48 ARDUINOMICRO.P$1
  Bottom 0.254: DRIVER3.PWMA 86.26,35.16 87.88,33.54 87.88,21.75 86.26,20.13 DRIVER3.PWMB 86.05,19.92 83.41,17.28 83.41,11.39 78.13,6.11 63.5,6.11 62.89,5.5 62.69,5.7 61.26,5.7 57.4,1.84 52.53,1.84 50.49,3.87 39.72,3.87 39.32,4.28 38.3,4.28 ARDUINOMICRO.P$1 | v31.8,10.78 31.8,16.67 30.78,17.69 29.77,17.69 JP1.7
MISO  (via drill 0.35)
  Top 0.254: v36.47,45.12 37.69,46.34 38.91,46.34 40.13,45.12 40.13,43.7 42.16,41.67 v45.01,41.67 | v46.83,39.84 50.9,39.84 53.34,42.28 ARDUINOMICRO.P$19
  Bottom 0.254: v36.47,45.12 36.47,44.51 30.17,38.21 29.77,38.21 JP1.15 | v46.83,39.84 v45.01,41.67
MOSI
  Top 0.254: JP1.18 29.77,45.53 35.05,45.53 36.27,44.31 37.49,44.31 38.1,44.92 ARDUINOMICRO.P$17
N$1
  Top 0.254: R_PB_LED.2 83.21,70.52 89.1,70.52 90.32,71.74 91.95,71.74 93.16,70.52 PB_LED.2
PB_LED  (via drill 0.35)
  Top 0.254: v65.73,68.89 55.98,68.89 52.73,65.64 50.7,65.64 49.88,64.83 49.88,64.02 48.87,63 34.03,63 32.41,64.63 PCF1.12
  Bottom 0.254: v65.73,68.89 66.95,68.89 70,71.94 78.94,71.94 80.36,70.52 R_PB_LED.1
RESET  (via drill 0.35)
  Top 0.254: v70.61,61.38 86.46,61.38 92.35,67.27 92.96,67.27 PB_SWITCH.2 | v56.79,54.26 56.79,53.86 54.96,52.03 54.96,51.22 52.93,49.18 51.92,49.18 v51.51,48.78 | v51.71,45.53 51.31,45.53 47.65,41.87 46.23,41.87 39.32,34.96 38.3,34.96 ARDUINOMICRO.P$22
  Bottom 0.254: v70.61,61.38 63.5,54.26 v56.79,54.26 | v51.51,48.78 51.51,45.73 v51.71,45.53
RX
  Top 0.254: JP1.13 29.77,33.13 34.03,33.13 38.1,37.2 ARDUINOMICRO.P$14
SCK  (via drill 0.35)
  Top 0.254: v26.52,45.93 26.52,43.7 29.56,40.65 JP1.16
  Bottom 0.254: v26.52,45.93 26.52,50.4 28.34,52.23 35.46,52.23 41.96,45.73 50.49,45.73 51.51,44.71 52.53,44.71 52.73,44.92 53.34,44.92 ARDUINOMICRO.P$18
SCL  (via drill 0.35)
  Top 0.254: v76.5,34.55 71.42,39.63 67.97,39.63 PCF2.14 | v19.2,34.76 23.06,34.76 28.75,29.07 36.27,29.07 38.1,27.24 ARDUINOMICRO.P$10
  Bottom 0.254: v76.5,34.55 76.5,17.69 74.67,15.86 73.25,15.86 69.59,12.2 69.39,12.2 PCF3.14 69.19,12 68.78,12 62.89,6.11 61.06,6.11 57.2,2.25 52.73,2.25 39.72,15.25 39.72,25.61 38.3,27.03 ARDUINOMICRO.P$10 | v19.2,34.76 17.98,35.98 17.98,36.18 R_SCL.1 17.78,36.38 19,37.6 19,56.91 26.72,64.63 27.12,64.63 PCF1.14
SDA  (via drill 0.35)
  Top 0.254: v66.34,30.08 66.34,29.47 67.36,28.46 68.17,28.46 70.81,25.82 70.81,24.8 66.75,20.74 66.75,12.2 PCF3.15 | R_SDA.1 17.78,42.07 19,42.07 20.01,43.09 20.62,43.09 27.73,35.98 27.73,32.52 28.75,31.51 36.47,31.51 38.1,29.88 ARDUINOMICRO.P$11
  Bottom 0.254: v66.34,30.08 66.34,40.45 67.77,41.87 67.77,42.28 PCF2.15 | PCF1.15 24.48,64.63 24.28,64.63 17.78,58.12 17.78,42.07 R_SDA.1 | PCF3.15 66.55,12 66.34,12 57,2.65 52.93,2.65 40.13,15.45 40.13,27.65 38.1,29.68 ARDUINOMICRO.P$11
SS
  Top 0.254: JP1.17 29.77,43.09 37.49,43.09 38.1,42.48 ARDUINOMICRO.P$16
TX
  Top 0.254: JP1.14 29.77,35.57 33.83,35.57 38.1,39.84 ARDUINOMICRO.P$15
V3.3  (via drill 0.35)
  Top 0.254: v43.18,33.13 43.18,18.09 52.12,9.15 52.12,8.14 53.34,6.92 ARDUINOMICRO.P$33
  Bottom 0.254: v43.18,33.13 40.54,35.77 40.54,45.12 38.91,46.75 38.3,46.75 36.47,48.57 32.61,48.57 32.41,48.37 29.77,48.37 JP1.19
V_BATT
  Top 0.254: SWITCH.O 5.59,11.59 5.59,12.61 9.24,16.27 9.24,24.19 POWR-PLUG.POW
V_MOT  (via drill 0.35)
  Top 0.254: 12.7,6.51 12.7,5.5 C1.1 | 12.7,6.51 16.56,10.37 VREG.1 | 12.7,6.51 8.84,6.51 4.37,10.98 4.37,12.2 5.38,13.22 5.38,14.03 SWITCH.P | v69.19,24.19 59.43,24.19 54.96,28.66 54.96,38.41 53.54,39.84 ARDUINOMICRO.P$20
  Bottom 0.254: DRIVER1.VMOT 64.11,51.62 64.11,51.01 68.58,46.54 70.2,46.54 73.86,42.89 DRIVER2.VMOT 74.06,42.89 74.47,42.89 75.69,41.67 75.69,22.36 73.66,20.33 73.66,20.13 DRIVER3.VMOT 73.45,20.13 73.25,20.13 v69.19,24.19 | ARDUINOMICRO.P$20 53.34,40.04 53.34,40.45 48.46,45.32 41.75,45.32 36.47,50.61 29.77,50.61 JP1.20 29.56,50.61 28.95,50.61 27.33,48.98 27.33,41.26 15.95,29.88 15.95,24.8 5.59,14.44 5.59,14.23 SWITCH.P
VCC
  Top 0.254: 71.63,63.41 71.63,64.22 M1_ENC.1 71.63,63.41 | 71.63,63.41 69.8,61.58 69.8,59.95 73.45,56.3 | 73.45,56.3 73.86,55.89 DRIVER2.VCC | 71.63,63.41 72.64,62.39 81.58,62.39 89.51,70.32 90.52,70.32 PB_LED.1 | M5_ENC.1 95.2,10.78 95.2,21.95 LED5.A | PCF3.2 66.55,4.68 66.55,9.76 64.31,12 PCF3.16 | 94.79,50.81 94.79,55.69 M3_ENC.1 | 94.79,50.81 95.4,50.2 LED3.A | 94.79,50.81 91.13,50.81 87.07,46.75 86.26,46.75 77.72,38.21 77.72,34.15 76.3,32.73 73.66,32.73 DRIVER3.VCC | 73.45,56.3 62.08,44.92 60.45,44.92 PCF2.1 | M0_ENC.1 11.48,64.42 11.48,67.27 10.26,68.49 10.26,70.93 10.87,71.54 19.61,71.54 21.03,70.11 LED0.A | PCF1.16 22.05,64.83 22.05,69.1 21.23,69.91 LED0.A | LED1.A 53.74,70.11 35.25,70.11 34.03,71.33 22.45,71.33 21.23,70.11 LED0.A | 2.74,31.71 2.74,32.52 1.73,33.54 1.73,40.45 2.33,41.06 LED4.A 2.54,41.26 2.54,47.56 M2_ENC.1 2.54,47.76 1.93,48.37 1.93,53.86 2.54,54.47 2.54,58.94 LED2.A | 2.74,31.71 2.74,29.88 M4_ENC.1 | C2.1 19.4,5.5 19.4,8.14 21.64,10.37 VREG.3 21.64,10.58 21.64,18.91 16.15,24.39 16.15,31.71 | R_SDA.2 20.42,41.87 20.42,36.38 R_SCL.2 | JP1.12 29.56,30.49 27.94,30.49 22.25,36.18 20.42,36.18 R_SCL.2 | 16.15,31.71 16.15,32.73 19.61,36.18 20.22,36.18 R_SCL.2 | 16.15,31.71 2.74,31.71
  Bottom 0.254: DRIVER1.VCC 51.31,51.62 51.31,51.42 57.4,45.32 59.84,45.32 60.25,44.92 PCF2.1 60.45,44.92 66.55,44.92 66.75,44.71 66.95,44.71 67.16,44.92 67.77,44.92 PCF2.16 67.77,44.71 69.39,43.09 69.39,36.38 73.05,32.73 73.45,32.73 DRIVER3.VCC 73.66,32.52 72.03,30.9 72.03,29.07 64.72,21.75 64.72,13.22 64.31,12.81 64.31,12.2 PCF3.16 | LED5.A 95.2,22.16 95.2,48.37 95.6,48.78 95.6,50 LED3.A | M0_ENC.1 11.48,64.42 8.02,64.42 2.74,59.14 LED2.A | M1_ENC.1 71.63,64.42 69.19,64.42 66.75,66.86 57,66.86 53.95,69.91 LED1.A
(copper drawn outside any net)
  shapes: Bottom area x4, Top area x4

### Text on the board
tPlace: off | on
bPlace: www.grasp.upenn.edu / TOBI v4.1 / tcdodson@gmail.com